# Altium schematic sheet STM32 MCU.SchDoc
size A4; SheetNumber: 1; SheetTotal: 9
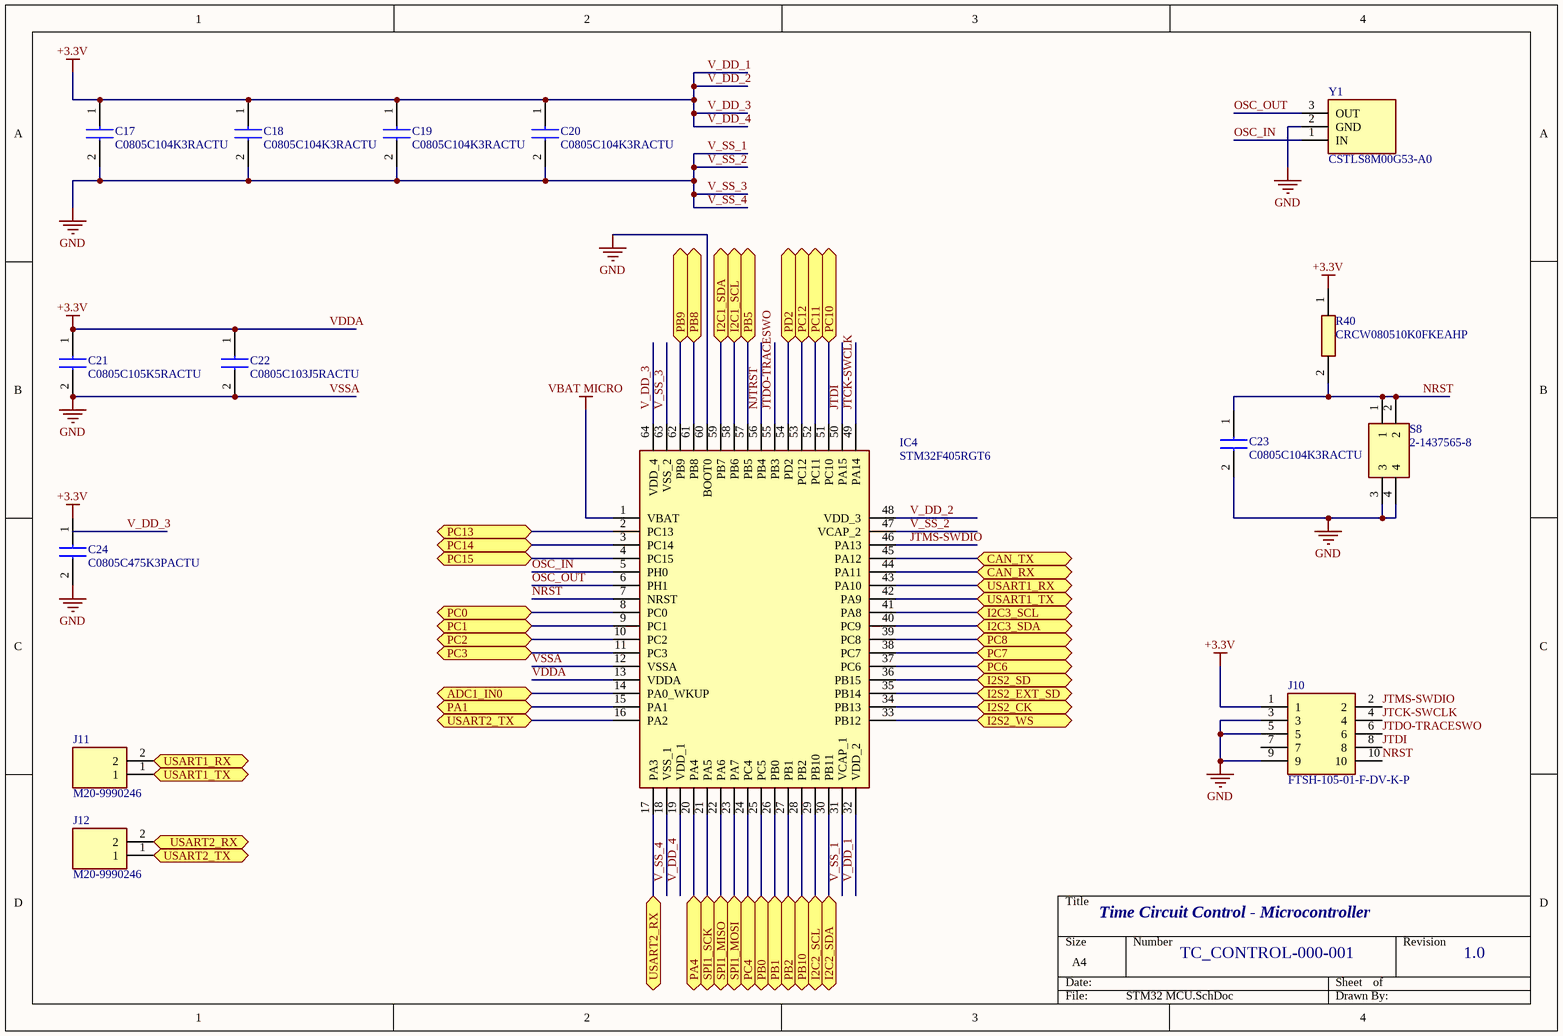
[diagram p0: STM32 MCU.SchDoc]

## Parts
C17  C0805C104K3RACTU  [CAPC2012X88N]
C18  C0805C104K3RACTU  [CAPC2012X88N]
C19  C0805C104K3RACTU  [CAPC2012X88N]
C20  C0805C104K3RACTU  [CAPC2012X88N]
C21  C0805C105K5RACTU  [CAPC2012X140N]
C22  C0805C103J5RACTU  [CAPC2012X88N]
C23  C0805C104K3RACTU  [CAPC2012X88N]
C24  C0805C475K3PACTU  [CAPC2013X140N]
IC4  STM32F405RGT6  [QFP50P1200X1200X160-64N]
J10  FTSH-105-01-F-DV-K-P  [FTSH-105-XX-YYY-DV-K-P]
J11  M20-9990246  [HDRV2W66P0X254_1X2_508X254X874P]
J12  M20-9990246  [HDRV2W66P0X254_1X2_508X254X874P]
R40  CRCW080510K0FKEAHP  [RESC2012X60N]
S8  2-1437565-8  [FSM2J_1]
Y1  CSTLS8M00G53-A0  [CSTLS8M00G53A0]

## Ports
ADC1_IN0, CAN_RX, CAN_TX, I2C1_SCL, I2C1_SDA, I2C2_SCL, I2C2_SDA, I2C3_SCL, I2C3_SDA, I2S2_CK, I2S2_EXT_SD, I2S2_SD, I2S2_WS, PA1, PA4, PB0, PB1, PB2, PB5, PB8, PB9, PB10, PC0, PC1, PC2, PC3, PC4, PC6, PC7, PC8, PC10, PC11, PC12, PC13, PC14, PC15, PD2, SPI1_MISO, SPI1_MOSI, SPI1_SCK, USART1_RX, USART1_TX, USART2_RX, USART2_TX

## Nets
V_DD_1: C17.1 C18.1 C19.1 C20.1 C21.1 C22.1 C24.1(C1) IC4.13(VDDA) IC4.19(VDD_1) IC4.32(VDD_2) IC4.48(VDD_3) IC4.64(VDD_4) J10.1 R40.1  [also labelled +3.3V, V_DD_2, V_DD_3, V_DD_4, VDDA]
V_SS_1: C17.2 C18.2 C19.2 C20.2 C21.2 C22.2 C23.2 C24.2(C2) IC4.12(VSSA) IC4.18(VSS_1) IC4.31(VCAP_1) IC4.47(VCAP_2) IC4.60(BOOT0) IC4.63(VSS_2) J10.3 J10.5 J10.9 S8.3 S8.4 Y1.2(GND)  [also labelled GND, V_SS_2, V_SS_3, V_SS_4, VSSA]
VBAT MICRO: IC4.1(VBAT)
ADC1_IN0: IC4.14(PA0_WKUP) ; port ADC1_IN0
CAN_RX: IC4.44(PA11) ; port CAN_RX
CAN_TX: IC4.45(PA12) ; port CAN_TX
I2C1_SCL: IC4.58(PB6) ; port I2C1_SCL
I2C1_SDA: IC4.59(PB7) ; port I2C1_SDA
I2C2_SCL: IC4.29(PB10) ; port I2C2_SCL
I2C2_SDA: IC4.30(PB11) ; port I2C2_SDA
I2C3_SCL: IC4.41(PA8) ; port I2C3_SCL
I2C3_SDA: IC4.40(PC9) ; port I2C3_SDA
I2S2_CK: IC4.34(PB13) ; port I2S2_CK
I2S2_EXT_SD: IC4.35(PB14) ; port I2S2_EXT_SD
I2S2_SD: IC4.36(PB15) ; port I2S2_SD
I2S2_WS: IC4.33(PB12) ; port I2S2_WS
JTCK-SWCLK: IC4.49(PA14) J10.4
JTDI: IC4.50(PA15) J10.8
JTDO-TRACESWO: IC4.55(PB3) J10.6
JTMS-SWDIO: IC4.46(PA13) J10.2
NJTRST: IC4.56(PB4)
NRST: C23.1 IC4.7(NRST) J10.10 R40.2 S8.1 S8.2
OSC_IN: IC4.5(PH0) Y1.1(IN)
OSC_OUT: IC4.6(PH1) Y1.3(OUT)
PA1: IC4.15(PA1) ; port PA1
PA4: IC4.20(PA4) ; port PA4
PB0: IC4.25(PC5) ; port PB0
PB1: IC4.26(PB0) ; port PB1
PB2: IC4.27(PB1) ; port PB2
PB5: IC4.57(PB5) ; port PB5
PB8: IC4.61(PB8) ; port PB8
PB9: IC4.62(PB9) ; port PB9
PB10: IC4.28(PB2) ; port PB10
PC0: IC4.8(PC0) ; port PC0
PC1: IC4.9(PC1) ; port PC1
PC2: IC4.10(PC2) ; port PC2
PC3: IC4.11(PC3) ; port PC3
PC4: IC4.24(PC4) ; port PC4
PC6: IC4.37(PC6) ; port PC6
PC7: IC4.38(PC7) ; port PC7
PC8: IC4.39(PC8) ; port PC8
PC10: IC4.51(PC10) ; port PC10
PC11: IC4.52(PC11) ; port PC11
PC12: IC4.53(PC12) ; port PC12
PC13: IC4.2(PC13) ; port PC13
PC14: IC4.3(PC14) ; port PC14
PC15: IC4.4(PC15) ; port PC15
PD2: IC4.54(PD2) ; port PD2
SPI1_MISO: IC4.22(PA6) ; port SPI1_MISO
SPI1_MOSI: IC4.23(PA7) ; port SPI1_MOSI
SPI1_SCK: IC4.21(PA5) ; port SPI1_SCK
USART1_RX: IC4.43(PA10) J11.2 ; port USART1_RX
USART1_TX: IC4.42(PA9) J11.1 ; port USART1_TX
USART2_RX: IC4.17(PA3) J12.2 ; port USART2_RX
USART2_TX: IC4.16(PA2) J12.1 ; port USART2_TX

Not connected (* = marked no-connect by the designer): J10 7

## Notes on the sheet
- Time Circuit Control - Microcontroller
- TC_CONTROL-000-001
- 1.0

## Library data of the parts
C17-C20 C23 = C0805C104K3RACTU: Capacitor; Manufacturer_Name: Kemet; Datasheet Link: https://componentsearchengine.com/Datasheets/2/C0805C104K3RACTU.pdf; Height: 0.88mm; Manufacturer_Part_Number: C0805C104K3RACTU; Mouser Part Number: 80-C0805C104K3R; Mouser Price/Stock: https://www.mouser.co.uk/ProductDetail/KEMET/C0805C104K3RACTU?qs=zZwvocWqSRjmUvfNxkIN%2Fg%3D%3D; Arrow Part Number: C0805C104K3RACTU; Arrow Price/Stock: https://www.arrow.com/en/products/c0805c104k3ractu/kemet-corporation
C21 = C0805C105K5RACTU: Capacitor; Manufacturer_Name: Kemet; Datasheet Link: http://www.kemet.com/docfinder?Partnumber=C0805C105K5RACTU; Height: 1.4mm; Manufacturer_Part_Number: C0805C105K5RACTU; Mouser Part Number: 80-C0805C105K5R; Mouser Price/Stock: https://www.mouser.co.uk/ProductDetail/KEMET/C0805C105K5RACTU/?qs=iP0bYSAMAFrBrUflcErrLQ%3D%3D; Arrow Part Number: C0805C105K5RACTU; Arrow Price/Stock: https://www.arrow.com/en/products/c0805c105k5ractu/kemet-corporation
C22 = C0805C103J5RACTU: Capacitor; Manufacturer_Name: Kemet; Datasheet Link: http://uk.rs-online.com/web/p/products/8029917; Height: 0.88mm; Manufacturer_Part_Number: C0805C103J5RACTU; Mouser Part Number: 80-C0805C103J5R; Mouser Price/Stock: https://www.mouser.co.uk/ProductDetail/KEMET/C0805C103J5RACTU/?qs=Onq5MIl0ZjiJ615hCkQQ7A%3D%3D; Arrow Part Number: C0805C103J5RACTU; Arrow Price/Stock: https://www.arrow.com/en/products/c0805c103j5ractu/kemet-corporation
C24 = C0805C475K3PACTU: Capacitor; Manufacturer_Name: Kemet; Manufacturer_Part_Number: C0805C475K3PACTU; Mouser Part Number: 80-C0805C475K3P; Mouser Price/Stock: https://www.mouser.co.uk/ProductDetail/KEMET/C0805C475K3PACTU?qs=K%2Fj%2Fqf%252B0fqKgIgOb3tBMNw%3D%3D; Arrow Part Number: C0805C475K3PACTU; Arrow Price/Stock: https://www.arrow.com/en/products/c0805c475k3pactu/kemet-corporation
IC4 = STM32F405RGT6: Integrated Circuit; Manufacturer_Name: STMicroelectronics; Datasheet Link: http://www.st.com/web/en/resource/technical/document/datasheet/DM00037051.pdf; Height: 1.6mm; Manufacturer_Part_Number: STM32F405RGT6; Mouser Part Number: 511-STM32F405RGT6; Mouser Price/Stock: https://www.mouser.co.uk/ProductDetail/STMicroelectronics/STM32F405RGT6?qs=Z8%252BeY1k3TIKgj7QWsYGpQw%3D%3D; Arrow Part Number: STM32F405RGT6; Arrow Price/Stock: https://www.arrow.com/en/products/stm32f405rgt6/stmicroelectronics?region=nac
J10 = FTSH-105-01-F-DV-K-P: Connector; Manufacturer_Name: SAMTEC; Datasheet Link: http://suddendocs.samtec.com/prints/ftsh-1xx-xx-xxx-dv-xxx-xxx-mkt.pdf; Manufacturer_Part_Number: FTSH-105-01-F-DV-K-P; Mouser Part Number: 200-FTSH10501FDVKP; Mouser Price/Stock: https://www.mouser.co.uk/ProductDetail/Samtec/FTSH-105-01-F-DV-K-P/?qs=0lQeLiL1qybhAFeR%252BoRWyg%3D%3D; Arrow Part Number: FTSH-105-01-F-DV-K-P; Arrow Price/Stock: https://www.arrow.com/en/products/ftsh-105-01-f-dv-k-p/samtec
J11 J12 = M20-9990246: Connector; Manufacturer_Name: Harwin; Datasheet Link: https://cdn.harwin.com/pdfs/M20-999.pdf; Height: 8.74mm; Manufacturer_Part_Number: M20-9990246; Mouser Part Number: 855-M20-9990246; Mouser Price/Stock: https://www.mouser.co.uk/ProductDetail/Harwin/M20-9990246?qs=Jph8NoUxIfWjw4WmyRvzag%3D%3D
R40 = CRCW080510K0FKEAHP: Resistor; Manufacturer_Name: Vishay; Datasheet Link: https://componentsearchengine.com/Datasheets/1/CRCW08051R00FKEAHP.pdf; Height: 0.6mm; Manufacturer_Part_Number: CRCW080510K0FKEAHP; Mouser Part Number: 71-CRCW080510K0FKEAH; Mouser Price/Stock: https://www.mouser.co.uk/ProductDetail/Vishay-Dale/CRCW080510K0FKEAHP/?qs=FlFvgi4rxBybVOW6oiRQjA%3D%3D; Arrow Part Number: CRCW080510K0FKEAHP; Arrow Price/Stock: https://www.arrow.com/en/products/crcw080510k0fkeahp/vishay
S8 = 2-1437565-8: Switch; Manufacturer_Name: TE Connectivity; Datasheet Link: https://componentsearchengine.com/Datasheets/1/2-1437565-8.pdf; Manufacturer_Part_Number: 2-1437565-8; Mouser Part Number: 506-2-1437565-8; Mouser Price/Stock: https://www.mouser.co.uk/ProductDetail/TE-Connectivity-PB/2-1437565-8/?qs=%2FwXgF%2FfIho9gWJ5kkeMo7w%3D%3D; Arrow Part Number: 2-1437565-8; Arrow Price/Stock: https://www.arrow.com/en/products/2-1437565-8/te-connectivity
Y1 = CSTLS8M00G53-A0: Crystal or Oscillator; Manufacturer_Name: Murata Electronics; Datasheet Link: https://www.murata.com/en-us/api/pdfdownloadapi?cate=cgsubResonators&partno=CSTLS8M00G53-A0; Height: 6.7mm; Manufacturer_Part_Number: CSTLS8M00G53-A0; Mouser Part Number: 81-CSTLS8M00G53-A0; Mouser Price/Stock: https://www.mouser.com/Search/Refine.aspx?Keyword=81-CSTLS8M00G53-A0; Arrow Part Number: CSTLS8M00G53-A0; Arrow Price/Stock: https://www.arrow.com/en/products/cstls8m00g53-a0/murata-manufacturing